# EAGLE design encoder (EAGLE 9.6.2)
AUTHOR: Felix Schofer; GENERATION: pasta; TITLE: Motor Encoder; VERSION: 05
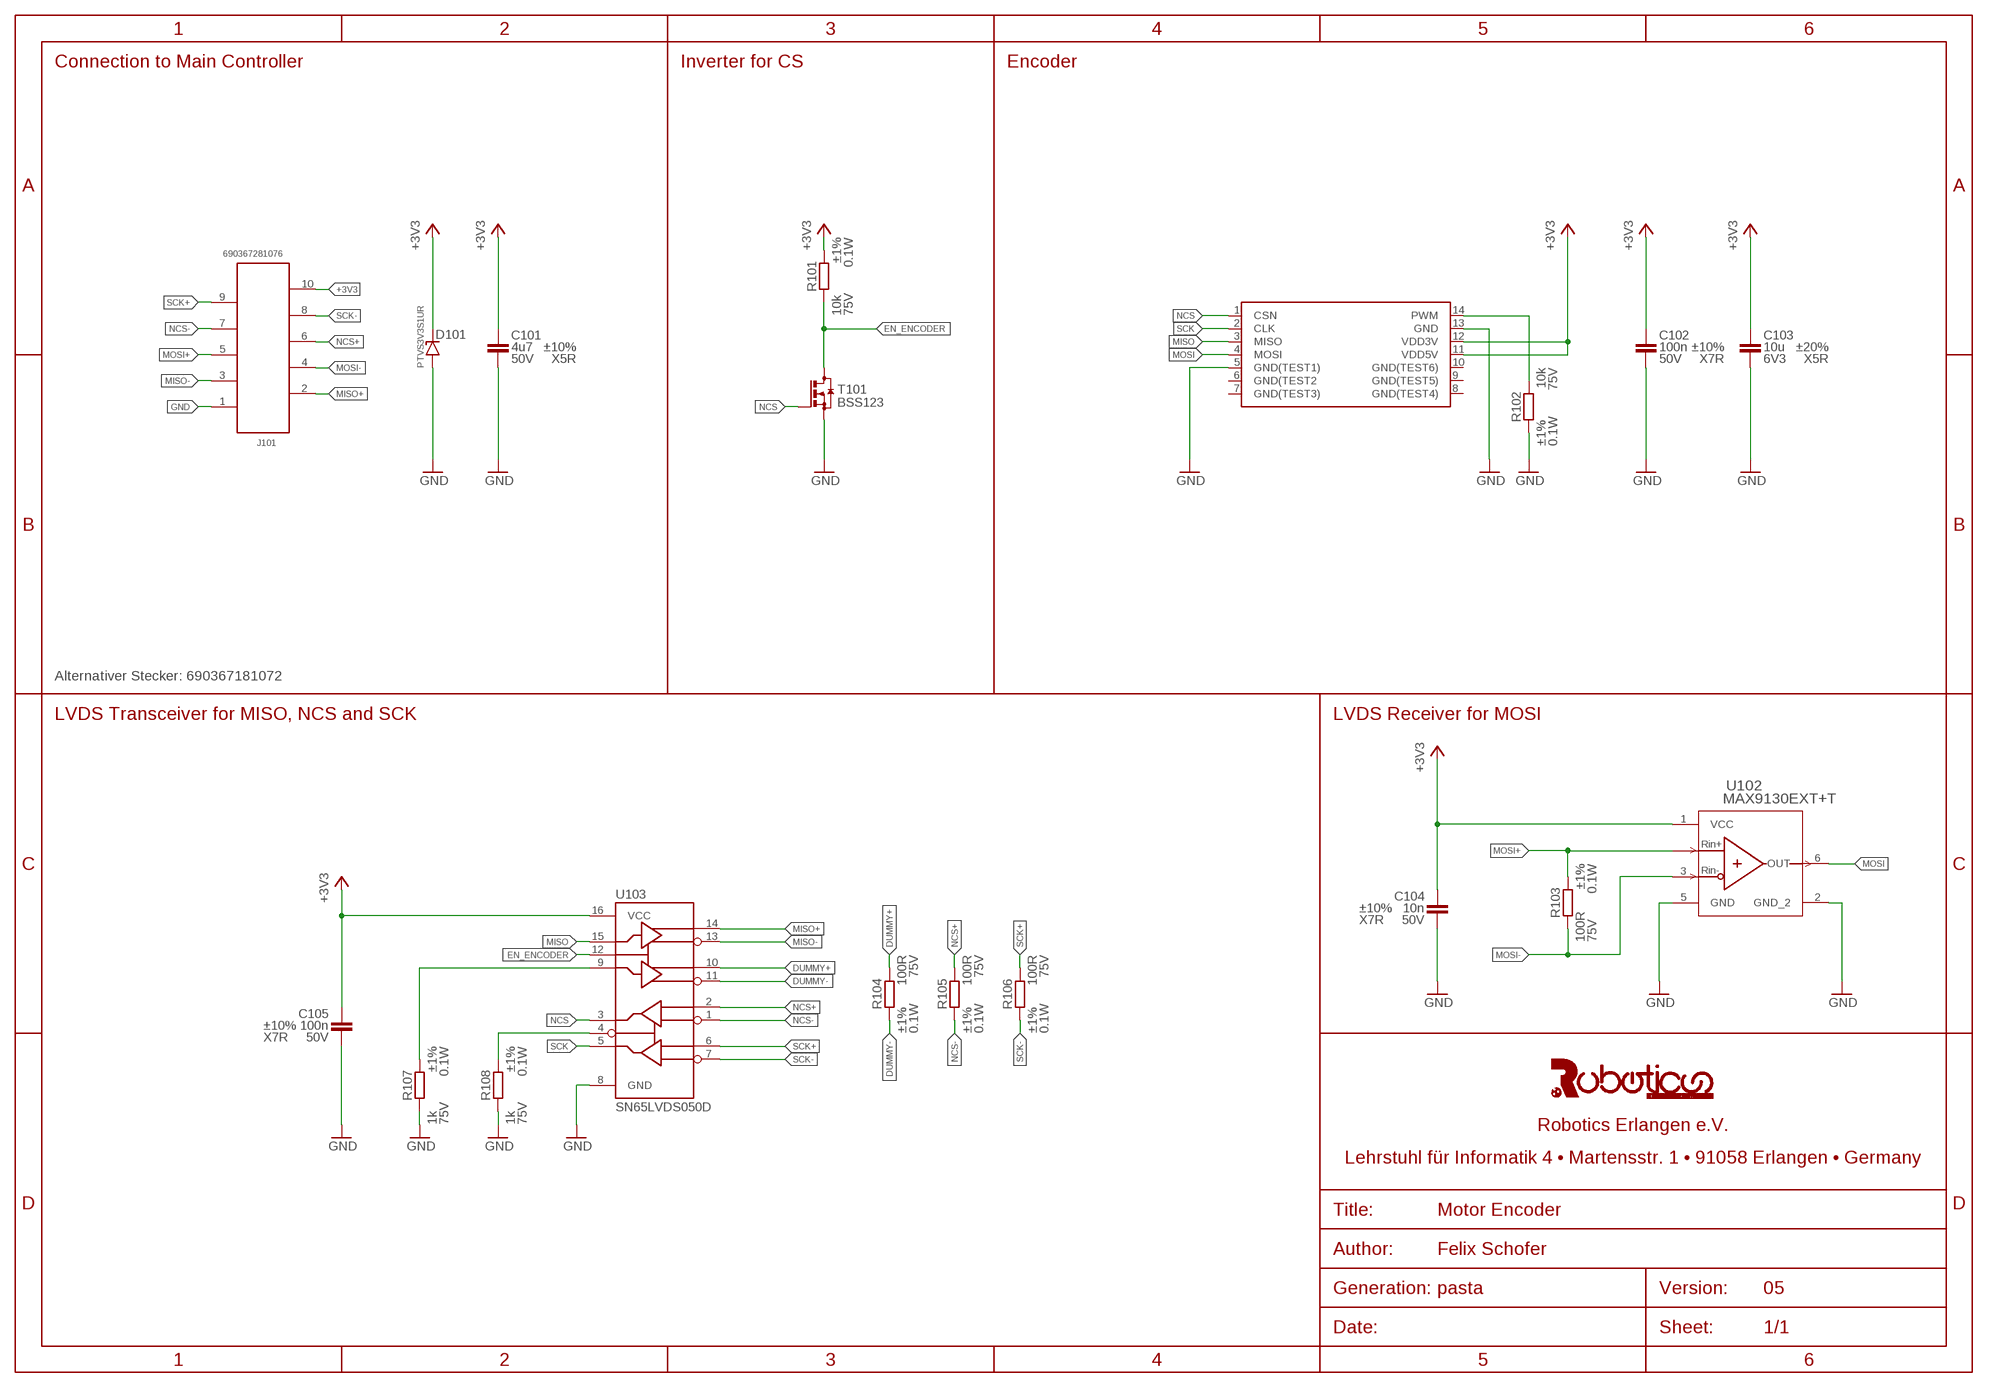
[diagram p0: schematic, sheet 1]

## Parts
C101  4u7 6V3  C(4.7UF,50V,0805)  [C0805]
C102  100n 6V3  C(100NF,50V,0603)  [C0603]
C103  10u 6V3  C(10UF,6.3V,0603)  [C0603]
C104  10n 50V  C(10NF,50V,0603)  [C0603]
C105  100n 6V3  C(100NF,50V,0603)  [C0603]
D101  PTVS3V3S1UR  [SOD123]
J101  690367281076  [690367281076]
R101  10k  R(10K,75V,0.1W,0603)  [R0603]
R102  10k  R(10K,75V,0.1W,0603)  [R0603]
R103  100R  R(100R,75V,0.1W,0603)  [R0603]
R104  100R  R(100R,75V,0.1W,0603)  [R0603]
R105  100R  R(100R,75V,0.1W,0603)  [R0603]
R106  100R  R(100R,75V,0.1W,0603)  [R0603]
R107  1k  R(1.0K,75V,0.1W,0603)  [R0603]
R108  1k  R(1.0K,75V,0.1W,0603)  [R0603]
T101  BSS123  [SOT23-3]
U101  AS5048A-HTSP  [AS5048A-HTSP]
U102  MAX9130EXT+T  [21-0077G_MXM]
U103  SN65LVDS050D  [SOIC-16]

## Nets
+3V3: C101.1 C102.1 C103.1 C104.1 C105.1 D101.C(KATHODE) J101.10 R101.2 U101.11(VDD5V) U101.12(VDD3V) U102.1(VCC) U103.16(VCC)
DUMMY+: R104.1 U103.10(2Y)
DUMMY-: R104.2 U103.11(2Z)
EN_ENCODER: R101.1 T101.3(D) U103.12(DE)
GND: C101.2 C102.2 C103.2 C104.2 C105.2 D101.A(ANODE) J101.1 R102.2 R107.1 R108.1 T101.2(S) U101.5(GND(TEST1)) U101.13(GND) U102.2(GND_2) U102.5(GND) U103.8(GND)
MISO: U101.3(MISO) U103.15(1D)
MISO+: J101.2 U103.14(1Y)
MISO-: J101.3 U103.13(1Z)
MOSI: U101.4(MOSI) U102.6(OUT)
MOSI+: J101.5 R103.2 U102.4(IN+)
MOSI-: J101.4 R103.1 U102.3(IN-)
N$1: R102.1 U101.14(PWM)
N$2: R108.2 U103.4(RE)
N$3: R107.2 U103.9(2D)
NCS: T101.1(G) U101.1(CSN) U103.3(1R)
NCS+: J101.6 R105.1 U103.2(1A)
NCS-: J101.7 R105.2 U103.1(1B)
SCK: U101.2(CLK) U103.5(2R)
SCK+: J101.9 R106.1 U103.6(2A)
SCK-: J101.8 R106.2 U103.7(2B)
Unconnected: U101.6(GND(TEST2) U101.7(GND(TEST3)) U101.8(GND(TEST4)) U101.9(GND(TEST5)) U101.10(GND(TEST6))

## Notes on the sheet
- Connection to Main Controller | Inverter for CS | Encoder
- Alternativer Stecker: 690367181072
- LVDS Transceiver for MISO, NCS and SCK | LVDS Receiver for MOSI

## Library data of the parts
C101 = capacitors:C(*?): Robotics Erlangen Capacitor Library This library provides a list of predefined capacitors with the following features: It is guaranteed that the capacitor exists with the given value, voltage rating and package size If you choose the capacitor you need (e.g. 2u2 with at least 50V) the package will be automatically choosen The manufacturer's data is automatically added so that exactly that capacitor will be ordered The value of the capacitor will be automatically filled with the most relevant data To choose a capacitor, you need to think about the voltage it must be rated for acc. to your application. Use below table to get a minimum voltage rating for the capacitor, depending on the maximum voltage that will be applied to it in your application. Maximum Voltage Applied Notes Minimum Voltage Rating ≤ 3.3V ≥ 6V3 ≤ 5.0V ≥ 10V ≤ 16.8V ≥ 25V ≤ 33.6V Includes all signals that are at max. VCC ≥ 50V After you determined the minimum voltage rating of the capacitor, search for it in the database of this library and choose the first one, that has at least that rating. The library is primarily sorted by capacitance values. Never change the value of predefined capacitors! Note: If your project requires a very specific capacitor (e.g. low tolerance, high voltage or E-24 upwards), then choose any of the predefined empty devices C(0402), C(0603), C(0805), C(1206), C(1210), or C(1812). Always set the attributes MF, MPN and VALUE for custom capacitors!; CAPACITANCE: 4u7; DIELECTRIC: X5R; MF: Samsung; MPN: CL21A475KBQNNNE; TOLERANCE: ±10%; VOLTAGE: 50V
C102 C105 = capacitors:C(*?): Robotics Erlangen Capacitor Library This library provides a list of predefined capacitors with the following features: It is guaranteed that the capacitor exists with the given value, voltage rating and package size If you choose the capacitor you need (e.g. 2u2 with at least 50V) the package will be automatically choosen The manufacturer's data is automatically added so that exactly that capacitor will be ordered The value of the capacitor will be automatically filled with the most relevant data To choose a capacitor, you need to think about the voltage it must be rated for acc. to your application. Use below table to get a minimum voltage rating for the capacitor, depending on the maximum voltage that will be applied to it in your application. Maximum Voltage Applied Notes Minimum Voltage Rating ≤ 3.3V ≥ 6V3 ≤ 5.0V ≥ 10V ≤ 16.8V ≥ 25V ≤ 33.6V Includes all signals that are at max. VCC ≥ 50V After you determined the minimum voltage rating of the capacitor, search for it in the database of this library and choose the first one, that has at least that rating. The library is primarily sorted by capacitance values. Never change the value of predefined capacitors! Note: If your project requires a very specific capacitor (e.g. low tolerance, high voltage or E-24 upwards), then choose any of the predefined empty devices C(0402), C(0603), C(0805), C(1206), C(1210), or C(1812). Always set the attributes MF, MPN and VALUE for custom capacitors!; CAPACITANCE: 100n; DIELECTRIC: X7R; MF: Würth Elektronik; MPN: 885012206095; TOLERANCE: ±10%; VOLTAGE: 50V
C103 = capacitors:C(*?): Robotics Erlangen Capacitor Library This library provides a list of predefined capacitors with the following features: It is guaranteed that the capacitor exists with the given value, voltage rating and package size If you choose the capacitor you need (e.g. 2u2 with at least 50V) the package will be automatically choosen The manufacturer's data is automatically added so that exactly that capacitor will be ordered The value of the capacitor will be automatically filled with the most relevant data To choose a capacitor, you need to think about the voltage it must be rated for acc. to your application. Use below table to get a minimum voltage rating for the capacitor, depending on the maximum voltage that will be applied to it in your application. Maximum Voltage Applied Notes Minimum Voltage Rating ≤ 3.3V ≥ 6V3 ≤ 5.0V ≥ 10V ≤ 16.8V ≥ 25V ≤ 33.6V Includes all signals that are at max. VCC ≥ 50V After you determined the minimum voltage rating of the capacitor, search for it in the database of this library and choose the first one, that has at least that rating. The library is primarily sorted by capacitance values. Never change the value of predefined capacitors! Note: If your project requires a very specific capacitor (e.g. low tolerance, high voltage or E-24 upwards), then choose any of the predefined empty devices C(0402), C(0603), C(0805), C(1206), C(1210), or C(1812). Always set the attributes MF, MPN and VALUE for custom capacitors!; CAPACITANCE: 10u; DIELECTRIC: X5R; MF: Würth Elektronik; MPN: 885012106006; TOLERANCE: ±20%; VOLTAGE: 6V3
C104 = capacitors:C(*?): Robotics Erlangen Capacitor Library This library provides a list of predefined capacitors with the following features: It is guaranteed that the capacitor exists with the given value, voltage rating and package size If you choose the capacitor you need (e.g. 2u2 with at least 50V) the package will be automatically choosen The manufacturer's data is automatically added so that exactly that capacitor will be ordered The value of the capacitor will be automatically filled with the most relevant data To choose a capacitor, you need to think about the voltage it must be rated for acc. to your application. Use below table to get a minimum voltage rating for the capacitor, depending on the maximum voltage that will be applied to it in your application. Maximum Voltage Applied Notes Minimum Voltage Rating ≤ 3.3V ≥ 6V3 ≤ 5.0V ≥ 10V ≤ 16.8V ≥ 25V ≤ 33.6V Includes all signals that are at max. VCC ≥ 50V After you determined the minimum voltage rating of the capacitor, search for it in the database of this library and choose the first one, that has at least that rating. The library is primarily sorted by capacitance values. Never change the value of predefined capacitors! Note: If your project requires a very specific capacitor (e.g. low tolerance, high voltage or E-24 upwards), then choose any of the predefined empty devices C(0402), C(0603), C(0805), C(1206), C(1210), or C(1812). Always set the attributes MF, MPN and VALUE for custom capacitors!; CAPACITANCE: 10n; DIELECTRIC: X7R; MF: Würth Elektronik; MPN: 885012206089; TOLERANCE: ±10%; VOLTAGE: 50V
D101 = encoder:PTVS*S1UR; MF: Nexperia; MOUSER: 771-PTVS3V3S1UR115; MPN: PTVS3V3S1UR,115
J101 = encoder:690367281076: WR-MM Female SMT Connector with Polarization, 10 Pins=>Code : Con_BTB_MM_Female_SMT_690367281076 <http://katalog.we-online.de/media/thumbs2/eican/thb_Con_BTB_MM_Female_SMT_69036728xx76_pf2.jpg> Details see: http://katalog.we-online.de/en/em/6903_6728_xx_76 Created 2014-06-04, Karrer Zheng 2014 (C) Würth Elektronik; MF: Würth Elektronik; MPN: 690367281076
R101 R102 = resistors:R(*?): Robotics Erlangen Resistor Library This library provides a list of predefined resistors with the following features: It is guaranteed that the resistor exists with the given value, voltage rating and package size If you choose the resistor you need (e.g. 10k with at least 75V and 0.1W) the package will be automatically choosen The manufacturer's data is automatically added so that exactly that resistor will be ordered The value of the resistor will be automatically filled with the most relevant data To choose a resistor, you have to determine the maximum operating voltage and power dissipation that will be applied to that resistor in your design. With these two values you can choose the minimum package acc. to below table, which lists the maximum operating voltage and power dissipation for each package. Always try to use a package with a voltage rating of at least twice your max. operating voltage and always keep a little marging between your power dissipation and the maximum power dissipation of the package (although typically, resistors can be overloaded by a factor of five for a short time period, i.e. less than a second). Package Maximum Operating Voltage Maximum Power Dissipation 0402 ≤ 50V ≤ 62.5 mW 0603 ≤ 75V ≤ 100 mW 0805 ≤ 150V ≤ 125 mW 1206 ≤ 200V ≤ 250 mW 1210 ≤ 200V ≤ 500 mW 2512 ≤ 200V ≤ 1 W Note: If your project requires a very specific resistor (e.g. low tolerance, high voltage / power dissipation or E-24 upwards), then choose any of the predefined empty devices R(0402), R(0603), R(0805), R(1206), R(1210), or R(2512). Always set the attributes MF, MPN and VALUE for custom resistors! Never change the value of non-custom resistors!; MF: YAGEO; MPN: RC0603FR-0710KL; POWER: 0.1W; RESISTANCE: 10k; TOLERANCE: ±1%; VOLTAGE: 75V
R103-R106 = resistors:R(*?): Robotics Erlangen Resistor Library This library provides a list of predefined resistors with the following features: It is guaranteed that the resistor exists with the given value, voltage rating and package size If you choose the resistor you need (e.g. 10k with at least 75V and 0.1W) the package will be automatically choosen The manufacturer's data is automatically added so that exactly that resistor will be ordered The value of the resistor will be automatically filled with the most relevant data To choose a resistor, you have to determine the maximum operating voltage and power dissipation that will be applied to that resistor in your design. With these two values you can choose the minimum package acc. to below table, which lists the maximum operating voltage and power dissipation for each package. Always try to use a package with a voltage rating of at least twice your max. operating voltage and always keep a little marging between your power dissipation and the maximum power dissipation of the package (although typically, resistors can be overloaded by a factor of five for a short time period, i.e. less than a second). Package Maximum Operating Voltage Maximum Power Dissipation 0402 ≤ 50V ≤ 62.5 mW 0603 ≤ 75V ≤ 100 mW 0805 ≤ 150V ≤ 125 mW 1206 ≤ 200V ≤ 250 mW 1210 ≤ 200V ≤ 500 mW 2512 ≤ 200V ≤ 1 W Note: If your project requires a very specific resistor (e.g. low tolerance, high voltage / power dissipation or E-24 upwards), then choose any of the predefined empty devices R(0402), R(0603), R(0805), R(1206), R(1210), or R(2512). Always set the attributes MF, MPN and VALUE for custom resistors! Never change the value of non-custom resistors!; MF: YAGEO; MPN: RC0603FR-07100RL; POWER: 0.1W; RESISTANCE: 100R; TOLERANCE: ±1%; VOLTAGE: 75V
R107 R108 = resistors:R(*?): Robotics Erlangen Resistor Library This library provides a list of predefined resistors with the following features: It is guaranteed that the resistor exists with the given value, voltage rating and package size If you choose the resistor you need (e.g. 10k with at least 75V and 0.1W) the package will be automatically choosen The manufacturer's data is automatically added so that exactly that resistor will be ordered The value of the resistor will be automatically filled with the most relevant data To choose a resistor, you have to determine the maximum operating voltage and power dissipation that will be applied to that resistor in your design. With these two values you can choose the minimum package acc. to below table, which lists the maximum operating voltage and power dissipation for each package. Always try to use a package with a voltage rating of at least twice your max. operating voltage and always keep a little marging between your power dissipation and the maximum power dissipation of the package (although typically, resistors can be overloaded by a factor of five for a short time period, i.e. less than a second). Package Maximum Operating Voltage Maximum Power Dissipation 0402 ≤ 50V ≤ 62.5 mW 0603 ≤ 75V ≤ 100 mW 0805 ≤ 150V ≤ 125 mW 1206 ≤ 200V ≤ 250 mW 1210 ≤ 200V ≤ 500 mW 2512 ≤ 200V ≤ 1 W Note: If your project requires a very specific resistor (e.g. low tolerance, high voltage / power dissipation or E-24 upwards), then choose any of the predefined empty devices R(0402), R(0603), R(0805), R(1206), R(1210), or R(2512). Always set the attributes MF, MPN and VALUE for custom resistors! Never change the value of non-custom resistors!; MF: YAGEO; MPN: RC0603FR-071KL; POWER: 0.1W; RESISTANCE: 1k; TOLERANCE: ±1%; VOLTAGE: 75V
T101 = encoder:BSS123: N-CHANNEL MOS FET; MF: Nexperia; MOUSER: 726-BSS123NH6327XTSA; MPN: BSS123NH6327XTSA1
U101 = encoder:AS5048A-HTSP; MF: ams; MOUSER: 985-AS5048A-HTSP-500; MPN: AS5048A-HTSP
U102 = encoder:MAX9130EXT+T; COPYRIGHT: Copyright (C) 2021 Ultra Librarian. All rights reserved.; MF: Maxim Integrated Products; MPN: MAX9130EXT+T
U103 = encoder:SN65LVDS050?*; MF: Texas Instruments; MPN: SN65LVDS050D

## Net classes
0 default: width 0.254 mm, drill 0.3 mm, clearance 0.1 mm

## Board
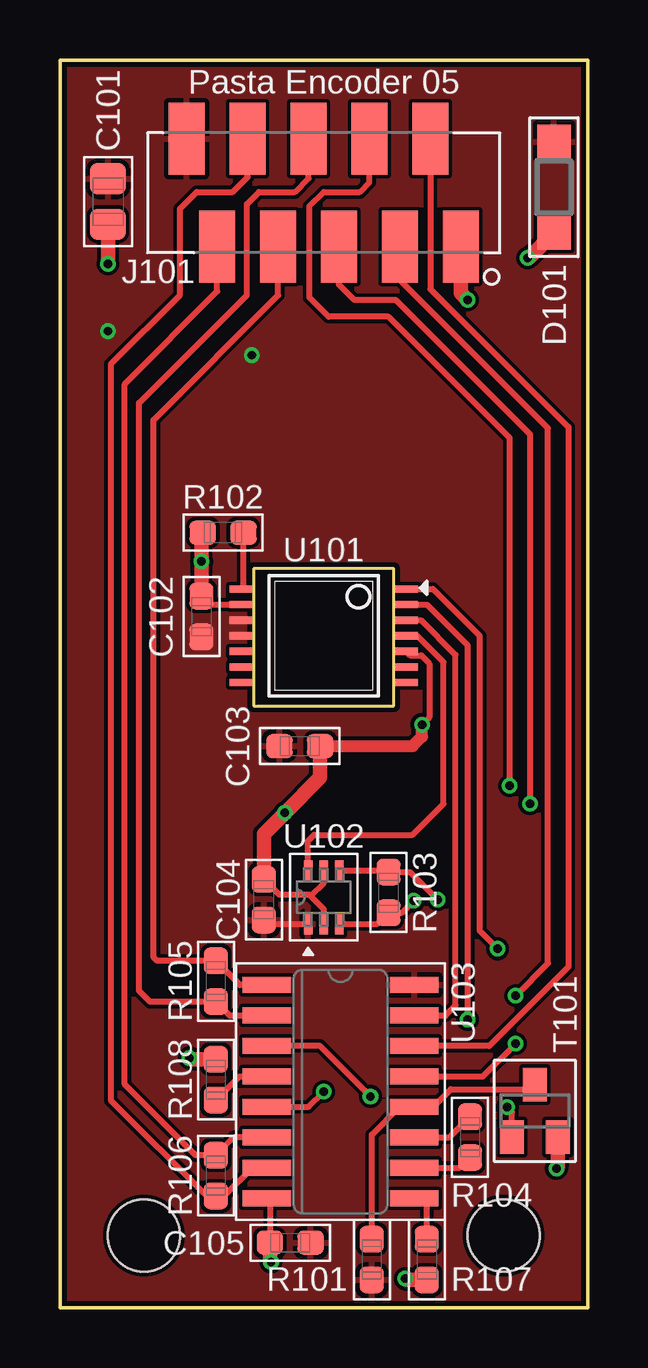
[diagram p1: board, top side]
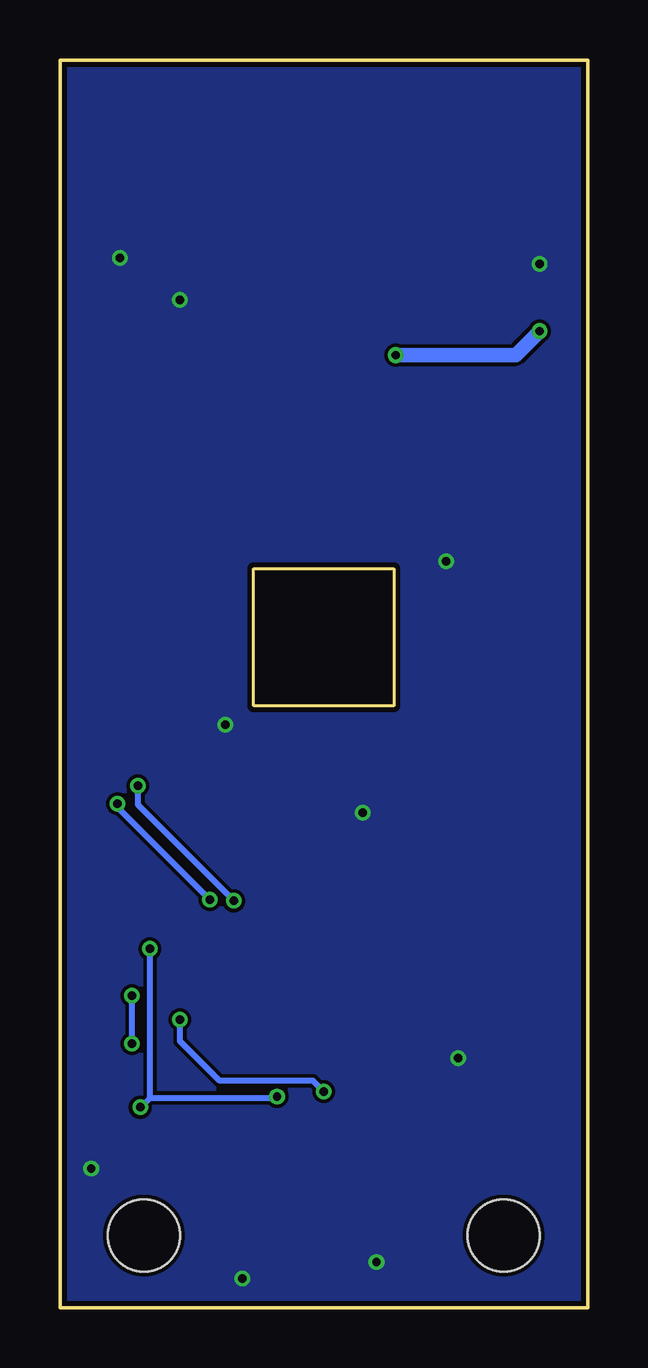
[diagram p2: board, bottom side, seen from below]

Size 22 x 52 mm. Coordinates in mm from the lower left corner, seen from the top.
Outline: 0,52 22,52 22,0 0,0 0,52
Copper layers (1*16): Top 0.035mm / dielectric 1.6mm / Bottom 0.035mm
Design rules "encoder": minimum track width 6mil, minimum drill 0.3mm, track to track 6mil, track to pad 6mil, pad to pad 6mil, via to via 6mil, smd to smd 0mil, copper to edge 0.2mm, drill to drill 6mil, minimum pad ring 0.15mm, minimum via ring 0.15mm, stop-mask expansion 0.05mm, vias tented up to drill 0.45mm, thermal gap 0.2mm
Holes 3 mm at 3.5,3 18.5,3

### Footprints (pad centres in the part's own frame; a part is rotated, then mirrored left to right if it is on the bottom)
C0805 = smd 1.3 x 1.5: 1 -0.95,0; 2 0.95,0
C0603 = smd 1.1 x 1: 1 -0.85,0; 2 0.85,0
SOD123 = smd 1.4 x 1.4: A 1.9,0; C -1.9,0
690367281076 = smd 1.5 x 3: 1 -5.715,2.25; 2 -4.445,-2.25; 3 -3.175,2.25; 4 -1.905,-2.25; 5 -0.635,2.25; 6 0.635,-2.25; 7 1.905,2.25; 8 3.175,-2.25; 9 4.445,2.25; 10 5.715,-2.25
R0603 = smd 1.1 x 1: 1 -0.85,0; 2 0.85,0
SOT23-3 = smd 1 x 1.4: 1 -0.95,-1.1; 2 0.95,-1.1; 3 0,1.1
AS5048A-HTSP = smd 0.305 x 0.991: 1 -1.95,3.432; 2 -1.3,3.432; 3 -0.65,3.432; 4 0,3.432; 5 0.65,3.432; 6 1.3,3.432; 7 1.95,3.432; 8 1.95,-3.432; 9 1.3,-3.432; 10 0.65,-3.432; 11 0,-3.432; 12 -0.65,-3.432; 13 -1.3,-3.432; 14 -1.95,-3.432
21-0077G_MXM = smd 0.871 x 0.355: 1 -1.108,0.65; 2 -1.108,0; 3 -1.108,-0.65; 4 1.108,-0.65; 5 1.108,0; 6 1.108,0.65
SOIC-16 = smd 0.66 x 2.032: 1 -4.445,-3.073; 2 -3.175,-3.073; 3 -1.905,-3.073; 4 -0.635,-3.073; 5 0.635,-3.073; 6 1.905,-3.073; 7 3.175,-3.073; 8 4.445,-3.073; 9 4.445,3.073; 10 3.175,3.073; 11 1.905,3.073; 12 0.635,3.073; 13 -0.635,3.073; 14 -1.905,3.073; 15 -3.175,3.073; 16 -4.445,3.073

### Placement (x,y rotation side)
C101  2,46.1 270 top
C102  5.9,28.8 90 top
C103  10,23.4 0 top
C104  8.5,17 90 top
C105  9.6,2.7 180 top
D101  20.6,46.7 270 top
J101  11,46.46 180 top
R101  13,2 270 top
R102  6.8,32.3 180 top
R103  13.7,17.3 90 top
R104  17.1,7.1 90 top
R105  6.5,13.6 90 top
R106  6.5,5.5 270 top
R107  15.3,2 90 top
R108  6.5,9.5 270 top
T101  19.8,8.2 0 top
U101  11,28 270 top
U102  11,17.1 90 top
U103  11.7,9 270 top

### Tracks (layer width: path | path; a pad name or v marks a point on that pad's centre or on a via)
+3V3  (via drill 0.35)
  Top 0.254: C104.1 8.66,15.99 U102.1
  Bottom 0.61: v2,40.7 3,39.7 v8,39.7
  pour Top: 0,52 22,52 22,0 0,0
  pour Top (no thermals): 4,25 18,25 18,31 4,31
  pour Top (no thermals): 1,38 9,38 9,42 1,42
DUMMY+
  Top 0.254: U103.10 16.68,5.82 R104.1
DUMMY-
  Top 0.254: U103.11 16.25,7.09 R104.2
EN_ENCODER
  Top 0.254: T101.3 19.6,9.1 16.3,9.1 15.57,8.36 U103.12 14.16,8.36 13,7.2 R101.1
GND  (via drill 0.35)
  Top 0.254: C104.2 9.15,17.2 10.4,17.2 10.45,17.15 | 10.45,17.15 11,16.6 U102.2 | U103.8 8.75,4.43 C105.2 | U101.13 6.35,29.3 6,29.65 C102.2 | U101.5 14.6,27.18 15.06,27.18 15.4,26.84 15.4,24.6 v15.1,24.3 | U102.5 11,17.7 10.45,17.15
  Top 0.508: C103.2 14.7,23.4 15.1,23.8 v15.1,24.3
  Top 0.61: J101.1 16.71,42.28 v17,42 | v5.4,10.4 5.45,10.35 R108.1 | C102.2 v5.9,31.1 5.9,32.25 R102.2 | C105.2 8.75,1.95 v8.8,1.9 | R107.1 14.45,1.15 v14.4,1.2 | C104.2 8.5,19.75 v9.38,20.62 10.85,22.1 C103.2 | v2,43.5 C101.2 | T101.2 20.75,5.85 v20.7,5.8 | v19.5,43.75 19.55,43.75 D101.A
  pour Bottom (no thermals): 0,52 22,52 22,0 0,0
MISO
  Top 0.254: U103.15 16.07,12.18 16.5,12.6 16.5,27.2 15.05,28.65 U101.3
MISO+
  Top 0.254: U103.14 17.91,10.91 21.2,14.2 21.2,36.7 15.45,42.45 J101.2
MISO-  (via drill 0.35)
  Top 0.254: U103.13 17.63,9.64 v19,11 | v19,13 20.35,14.35 20.35,36.65 14.18,42.82 J101.3
  Bottom 0.254: v19,11 v19,13
MOSI
  Top 0.254: U101.4 14.9,28 15.99,26.91 15.99,20.99 14.7,19.7 10.6,19.7 10.35,19.45 U102.6
MOSI+  (via drill 0.35)
  Top 0.254: v19.6,21 19.6,36.4 14,42 12.28,42 11.63,42.64 J101.5 | v15.75,17 14.6,18.15 R103.2 13.64,18.21 U102.4
  Bottom 0.254: v19.6,21 19.6,20.85 v15.75,17
MOSI-  (via drill 0.35)
  Top 0.254: v18.75,21.75 18.75,36.25 13.7,41.3 11.2,41.3 10.4,42.1 10.4,45.9 11,46.5 12.5,46.5 12.9,46.91 J101.4 | v14.75,16.95 14.25,16.45 R103.1 13.24,15.99 U102.3
  Bottom 0.254: v14.75,16.95 18.75,20.95 v18.75,21.75
N$1
  Top 0.254: U101.14 7.65,29.95 R102.1
N$2
  Top 0.254: R108.2 7.48,9.64 U103.4
N$3
  Top 0.254: R107.2 15.3,4.55 U103.9
NCS  (via drill 0.35)
  Top 0.254: v18.25,14.95 17.5,15.7 17.5,28 15.55,29.95 U101.1 | v12.95,8.8 10.85,10.91 U103.3 | T101.1 18.85,8.15 v18.65,8.35
  Bottom 0.254: v12.95,8.8 13,8.75 18.25,8.75 | 18.25,8.75 v18.65,8.35 | 18.25,8.75 v18.25,14.95
NCS+
  Top 0.254: J101.6 10.37,47.06 9.8,46.5 8.3,46.5 7.8,46 7.8,42.2 3.3,37.7 3.3,13.2 3.75,12.75 R105.1 7.08,12.18 U103.2
NCS-
  Top 0.254: J101.7 9.1,42.2 3.9,37 3.9,14.6 4.05,14.45 R105.2 7.5,13.45 U103.1
SCK  (via drill 0.35)
  Top 0.254: v17,12 17,27.6 15.3,29.3 U101.2 | U103.5 10.37,8.36 v11,9
  Bottom 0.254: v11,9 11.45,9.45 15.35,9.45 17,11.1 v17,12
SCK+
  Top 0.254: J101.9 6.55,42.36 2.7,38.5 2.7,9.3 5.65,6.35 R106.1 7.25,7.09 U103.6
SCK-
  Top 0.254: J101.8 7.83,47.12 7.2,46.5 5.7,46.5 5,45.8 5,42.2 2.12,39.32 2.12,8.64 6.11,4.65 R106.2 6.85,4.65 8.03,5.82 U103.7

### Text on the board
tPlace: Pasta Encoder 05